# Altium schematic sheet MCU.SchDoc
size A; SheetNumber: 1; SheetTotal: 4
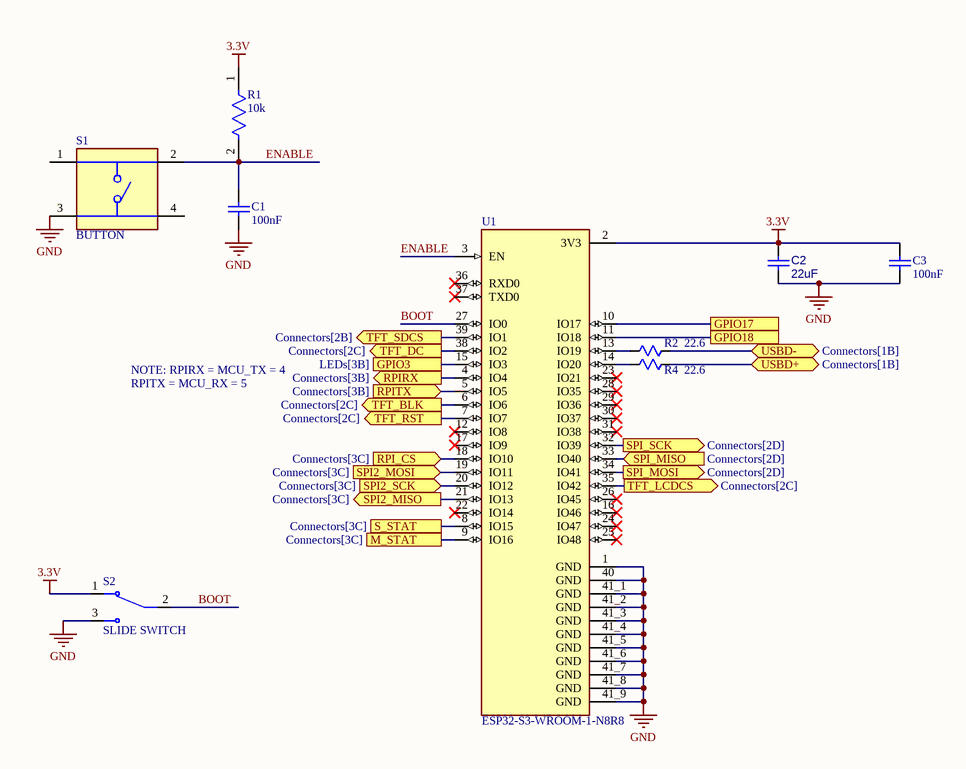
[diagram p0: MCU.SchDoc]

## Parts
C1  100nF  [CAPC1608X90X35LL10T15]
C2  22uF  [CAPC1608X09N]
C3  100nF  [CAPC1608X90X35LL10T15]
R1  10k  [FP-CRGP0603-IPC_C]
R2  22.6  [RESC1608X06N]
R4  22.6  [RESC1608X06N]
S1  BUTTON  [SW_TS02-66-43-BK-100-SCR-D]
S2  SLIDE SWITCH  [SW_SLW-883935-2A-D]
U1  ESP32-S3-WROOM-1-N8R8  [XCVR_ESP32S3WROOM1N8R8]

## Ports
GPIO3 (see LEDs[3B]), GPIO17, GPIO18, M_STAT (see Connectors[3C]), RPI_CS (in, see Connectors[3C]), RPIRX (out, see Connectors[3B]), RPITX (in, see Connectors[3B]), S_STAT (see Connectors[3C]), SPI2_MISO (out, see Connectors[3C]), SPI2_MOSI (in, see Connectors[3C]), SPI2_SCK (in, see Connectors[3C]), SPI_MISO (in, see Connectors[2D]), SPI_MOSI (out, see Connectors[2D]), SPI_SCK (out, see Connectors[2D]), TFT_BLK (out, see Connectors[2C]), TFT_DC (out, see Connectors[2C]), TFT_LCDCS (out, see Connectors[2C]), TFT_RST (out, see Connectors[2C]), TFT_SDCS (out, see Connectors[2B]), USBD+ (bidir, see Connectors[1B]), USBD- (bidir, see Connectors[1B])

## Nets
3.3V: C2.2 C3.2 R1.1 S2.1 U1.2(3V3)
GND: C1.1 C2.1 C3.1 S1.3 S2.3 U1.1(GND) U1.40(GND) U1.41_1(GND) U1.41_2(GND) U1.41_3(GND) U1.41_4(GND) U1.41_5(GND) U1.41_6(GND) U1.41_7(GND) U1.41_8(GND) U1.41_9(GND)
BOOT: S2.2 U1.27(IO0)
ENABLE: C1.2 R1.2 S1.2 U1.3(EN)
GPIO3: U1.15(IO3) ; port GPIO3
GPIO17: U1.10(IO17) ; port GPIO17
GPIO18: U1.11(IO18) ; port GPIO18
M_STAT: U1.9(IO16) ; port M_STAT
RPI_CS: U1.18(IO10) ; port RPI_CS
RPIRX: U1.4(IO4) ; port RPIRX
RPITX: U1.5(IO5) ; port RPITX
S_STAT: U1.8(IO15) ; port S_STAT
SPI2_MISO: U1.21(IO13) ; port SPI2_MISO
SPI2_MOSI: U1.19(IO11) ; port SPI2_MOSI
SPI2_SCK: U1.20(IO12) ; port SPI2_SCK
SPI_MISO: U1.33(IO40) ; port SPI_MISO
SPI_MOSI: U1.34(IO41) ; port SPI_MOSI
SPI_SCK: U1.32(IO39) ; port SPI_SCK
TFT_BLK: U1.6(IO6) ; port TFT_BLK
TFT_DC: U1.38(IO2) ; port TFT_DC
TFT_LCDCS: U1.35(IO42) ; port TFT_LCDCS
TFT_RST: U1.7(IO7) ; port TFT_RST
TFT_SDCS: U1.39(IO1) ; port TFT_SDCS
USBD+: R4.2 ; port USBD+
USBD-: R2.2 ; port USBD-
NetR2_1: R2.1 U1.13(IO19)
NetR4_1: R4.1 U1.14(IO20)

Not connected (* = marked no-connect by the designer): S1 1 4; U1 12(IO8)* 16(IO46)* 17(IO9)* 22(IO14)* 23(IO21)* 24(IO47)* 25(IO48)* 26(IO45)* 28(IO35)* 29(IO36)* 30(IO37)* 31(IO38)* 36(RXD0)* 37(TXD0)*

## Notes on the sheet
- NOTE: RPIRX = MCU_TX = 4
- RPITX = MCU_RX = 5

## Library data of the parts
C1 C3 = CMP-2006-02868-1: Part Number: GRM188R71E104KA01D; Manufacturer: Murata
C2 = CMP-003-000012-1: CAP CER 22uF 10V X5R Symbols/Capacitor-Generic.SchLib; Part Number: CAP-0603-000010; Manufacturer Part Number 1: GRM187R61A226ME15#; Manufacturer 1: Murata; Value: 22µF; Tolerance: 20%; Voltage: 10V; Symbol Path: Symbols/Capacitor-Generic.SchLib; Temperature Characteristic: X5R
R1 = CMP-03211-004414-1: CRGP 0603 10K 1%; Manufacturer Part Number: CRGP0603F10K; Manufacturer: TE; Voltage Rating: 50V; Power Rating: 0.25W; Value: 10KΩ; Tolerance: 0.01; Temperature Coefficient: ±100ppm/°C; Octopart: https://octopart.com/crgp0603f10k-te+connectivity-91018721; Temperature Range Low: -55°C; Temperature Range High: +155°C; Device Class L3: Chip SMD Resistors; Package: CRGP0603; Height: 0.55mm; Series: CRGP; RoHS: TRUE; Composition: Thick Film; Digikey Description: CRGP 0603 10K 1%; Ipc Land Pattern Name: RESC16080X45; Mouser Description: Res, 10K, 1%, 0.25W, 0603, Thick Film; ComponentLink2Description: Datasheet; ComponentLink2URL: https://www.te.com/commerce/DocumentDelivery/DDEController?Action=srchrtrv&DocNm=9-1773463-9&DocType=DS&DocLang=English; Temperature: -55°C to +155°C; Device Class L1: Passive Components; Lead Free: Yes; Ambient Temperature Range High: +70°C; Device Class L2: Resistors; Automotive: No; Category: Res; Resistance: 10KΩ
R2 R4 = CMP-007-000132-1: RES 22.6 OHM 1% 1/10W 0603; Part Number: RES-0603-22R6-001; Manufacturer Part Number 1: RC0603FR-0722R6L; Manufacturer 1: Yageo; Value: 22.6R; Tolerance: 0.01%; Symbol Path: Symbols/Resistor_Generic.SchLib; Manufacturer 3: Vishay Dale; Manufacturer Part Number 3: CRCW060322R6FKED; Manufacturer 2: Stackpole Electronics; Manufacturer Part Number 2: RMCF0603FT22R6
S1 = CMP-00010-2: Switch Tactile OFF (ON) SPST Round Button PC Pins 0.05A 12VDC 100000Cycles 1N Thru-Hole Bag; Insulation Resistance: 100MΩ; Number of Positions: 1; Operating Force: 980mN; Electrical Life: 100kcycles; Max Current Rating: 50mA; Max Voltage Rating (DC): 12V; Min Operating Temperature: -30°C; Height: 3.5mm; Housing Material: Stainless Steel; Throw Configuration: SPST; Contact Plating: Silver; REACH SVHC: Yes; Lifecycle Status: Production; Terminal Material: Brass; Color: Black; Length: 6mm; Contact Resistance: 100mΩ; Max Operating Temperature: 80°C; Schedule B: 8536509030, 8536509065, 8536509065; RoHS: Compliant
S2 = CMP-00009-3: Switch Slide ON ON SPDT Raised Slide 0.5A 30VDC 10000Cycles PC Pins Thru-Hole Box; Number of Positions: 2; REACH SVHC: Yes; RoHS: Compliant; Lifecycle Status: Production
U1 = ESP32-S3-WROOM-1-N8R8: Bluetooth, WiFi 802.11b/g/n, Bluetooth v5.0 Transceiver Module 2.4GHz PCB Trace Surface Mount; MF: Espressif Systems; Package: None; Price: None; Check_prices: https://www.snapeda.com/parts/ESP32-S3-WROOM-1-N8R8/Espressif+Systems/view-part/?ref=eda; Value: *; SnapEDA_Link: https://www.snapeda.com/parts/ESP32-S3-WROOM-1-N8R8/Espressif+Systems/view-part/?ref=snap; MP: ESP32-S3-WROOM-1-N8R8; Availability: In Stock; Purchase-URL: https://pricing.snapeda.com/search?q=ESP32-S3-WROOM-1-N8R8&ref=eda